# Altium schematic sheet UC3843_Buck.SchDoc
size A4
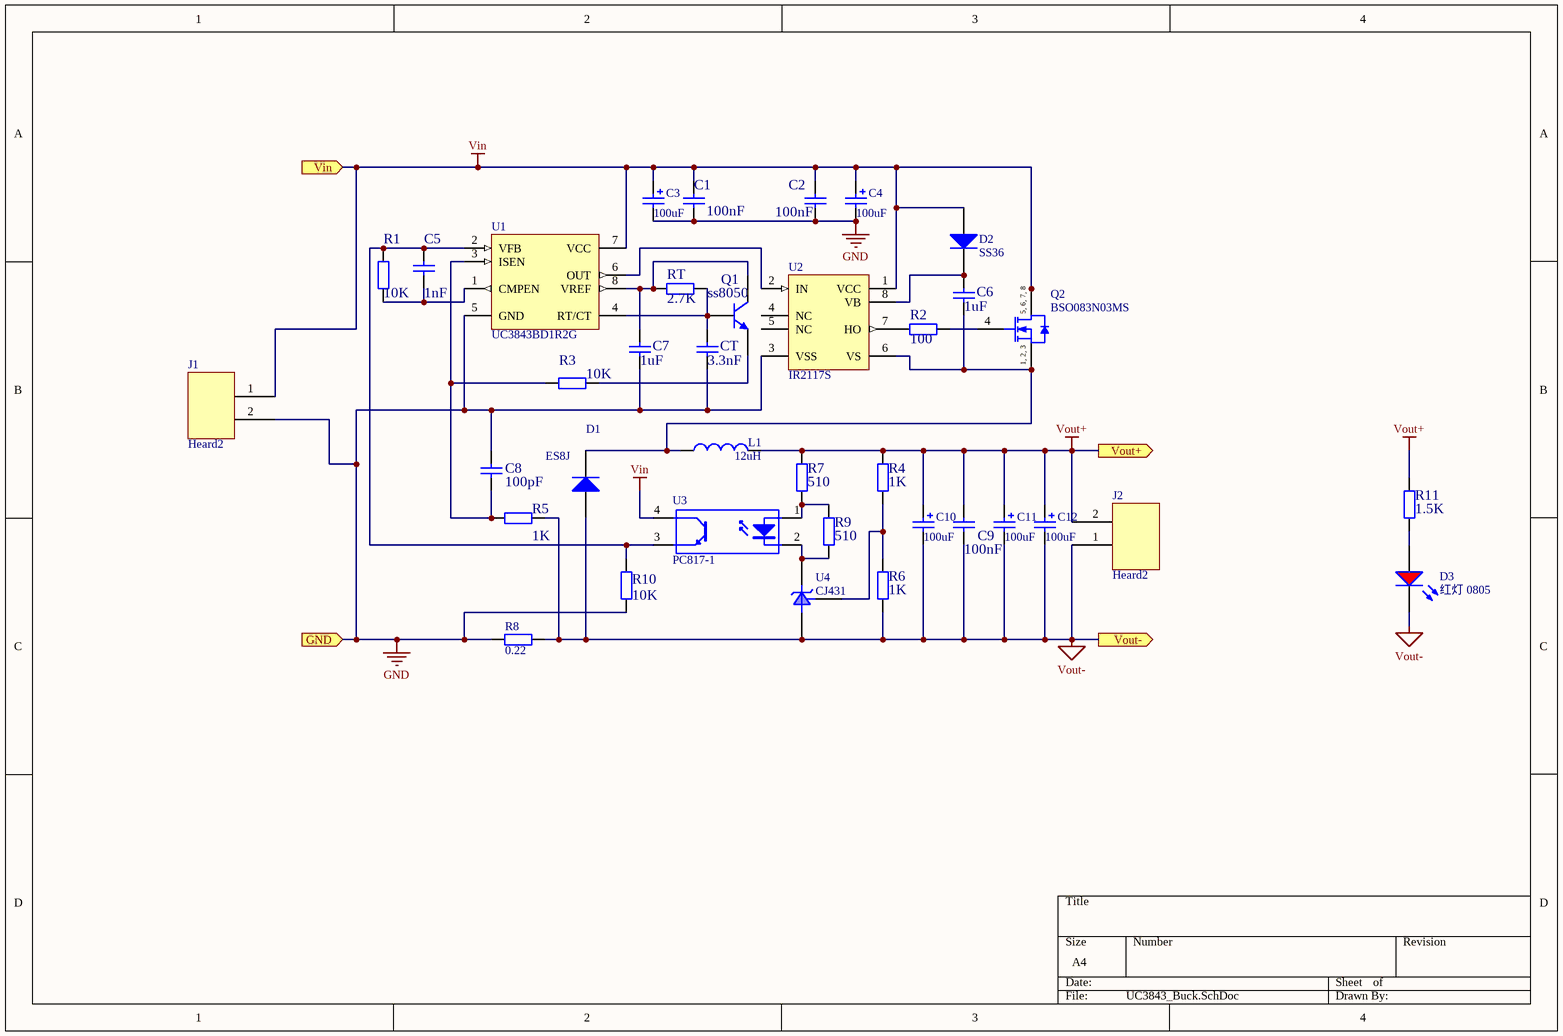
[diagram p0: UC3843_Buck.SchDoc]

## Parts
C1  100nF  [0805_C]
C2  100nF  [0805_C]
C3  100uF  [CASE-B_3528]
C4  100uF  [CASE-B_3528]
C5  1nF  [0805_C]
C6  1uF  [0805R]
C7  1uF  [0805R]
C8  100pF  [0805R]
C9  100nF  [0805_C]
C10  100uF  [CASE-B_3528]
C11  100uF  [CASE-B_3528]
C12  100uF  [CASE-B_3528]
CT  3.3nF  [0805R]
D1  ES8J  [SMC(DO-214AB)_S1]
D2  SS36  [SMC(DO-214AB)_S1]
D3  红灯 0805  [0805_LED_S1]
J1  Heard2  [8.5端子]
J2  Heard2  [8.5端子]
L1  12uH  [L_12uh]
Q1  ss8050  [SOT-23(SOT-23-3)]
Q2  BSO083N03MS  [INF-PG-DSO-8-16_N]
R1  10K  [0805R]
R2  100  [0805R]
R3  10K  [0805R]
R4  1K  [0805R]
R5  1K  [0805R]
R6  1K  [0805R]
R7  510  [0805R]
R8  0.22  [水泥电阻]
R9  510  [0805R]
R10  10K  [0805R]
R11  1.5K  [0805R]
RT  2.7K  [0805R]
U1  UC3843BD1R2G  [SOIC-8_150mil]
U2  IR2117S  [SO-8_N]
U3  PC817-1  [LC-SMD-4]
U4  CJ431  [SOT-23(SOT-23-3)]

## Ports
GND (in), Vin (in), Vout+ (out), Vout- (out)

## Nets
GND: C1.1 C2.1 C3.2 C4.2 C7.2 C8.2 CT.2 J1.2 R8.1 R10.2 U1.5(GND) U2.3(VSS) ; port GND
Vin: C1.2 C2.2 C3.1 C4.1 D2.1(A) J1.1 Q2.5(DRAIN) Q2.6(DRAIN) Q2.7(DRAIN) Q2.8(DRAIN) U1.7(VCC) U2.1(VCC) U3.4(C) ; port Vin
Vout+: C9.2 C10.1 C11.1 C12.1 J2.2 L1.2 R4.2 R7.2 R11.2 ; port Vout+
Vout-: C9.1 C10.2 C11.2 C12.2 D1.1(A) D3.K J2.1 R5.1 R6.1 R8.2 U4.3(A) ; port Vout-
NetC5_1: C5.1 R1.2 U1.1(CMPEN)
NetC5_2: C5.2 R1.1 R10.1 U1.2(VFB) U3.3(E)
NetC6_1: C6.1 D2.2(K) U2.8(VB)
NetC6_2: C6.2 D1.2(K) L1.1 Q2.1(SOURCE) Q2.2(SOURCE) Q2.3(SOURCE) U2.6(VS)
NetC7_1: C7.1 Q1.3(C) RT.1 U1.8(VREF)
NetC8_1: C8.1 R3.2 R5.2 U1.3(ISEN)
NetCT_1: CT.1 Q1.1(B) RT.2 U1.4(RT/CT)
NetD3_A: D3.A R11.1
NetQ1_2: Q1.2(E) R3.1
NetQ2_4: Q2.4(GATE) R2.2
NetR2_1: R2.1 U2.7(HO)
NetR4_1: R4.1 R6.2 U4.1(R)
NetR7_1: R7.1 R9.2 U3.1(A)
NetR9_1: R9.1 U3.2(K) U4.2(K)
NetU1_6: U1.6(OUT) U2.2(IN)

Not connected (* = marked no-connect by the designer): U2 4(NC) 5(NC)

## Notes on the sheet
- (in symbol BSO083N03MS G) 5, 6, 7, 8; 1, 2, 3

## Library data of the parts
C1 C2 C5 C9 = 0805 100nF(104) 10% 50V: 贴片电容; ComponentLink1Description: 供应商链接; ComponentLink1URL: http://www.szlcsc.com/product/details_50686.html; Package: 0805; Supplier: LC; SuppliersPartNumber: C49678
C3 C4 C10-C12 = 3528 100uF (107) 10% 6.3V: 钽电容; ComponentLink1Description: 供应商链接; ComponentLink1URL: http://www.szlcsc.com/product/details_16815.html; Package: 3528; Supplier: LC; SuppliersPartNumber: C16133
C6-C8 CT = Cap: Capacitor; Published: 8-Jun-2000; LatestRevisionDate: 17-Jul-2002; LatestRevisionNote: Re-released for DXP Platform.; PackageReference: RAD-0.3; Publisher: Altium Limited; PackageDescription: Radial Cap, Thru-Hole; 2 Leads; 0.3 in Pin Spacing
  C6 C7: Value: 1uF
  C8: Value: 100pF
  CT: Value: 3.3nF
D1 D2 = SMC(DO-214AB) SS36-E3/57T: 二极管; ComponentLink1Description: 供应商链接; ComponentLink1URL: http://www.szlcsc.com/product/details_36698.html; Package: SMC(DO-214AB); Supplier: LC; SuppliersPartNumber: C35722
D3 = 0805 红灯: 发光二极管; ComponentLink1Description: 供应商链接; ComponentLink1URL: http://www.szlcsc.com/product/details_2668.html; Package: 0805; Supplier: LC; SuppliersPartNumber: C2295
J1 J2 = Header2
L1 = L_12uh
Q1 = SOT-23 SS8050 Y1: 三极管; ComponentLink1Description: 供应商链接; ComponentLink1URL: http://www.szlcsc.com/product/details_2507.html; Package: SOT-23; Supplier: LC; SuppliersPartNumber: C2150
Q2 = BSO083N03MS G: N-Channel OptiMOS 3 M-Series Power-MOSFET, 30 V VDS, 14 A ID, -55 to 150 degC, PG-DSO-8-16, Reel, Green; Manufacturer: Infineon; Green: TRUE; ID (max): 14 A; IDpuls (max): 98 A; Polarity: N; Ptot (max): 2.5 W; QG: 21 nC; RDS (on) (max): 8.3 mOhm; RDS (on) (max) (@4.5V): 10.5 mOhm; Rth: 35 K/W; RthJA (max): 150 K/W; VDS (max): 30 V; VGS(th) (max): 2 V; VGS(th) (min): 1 V; DatasheetVersion: Rev. 1.1; PackageVersion: Mar-07; PackageReference: PG-DSO-8-16; PackageDescription: 8-Pin Plastic (Green) Dual Small Outline Package, 4.9 x 3.9 mm Body, 1.27 mm Pitch; Supplier 1: Digi-Key; Supplier Part Number 1: BSO083N03MS GINTR-ND; Supplier 2: Digi-Key; Supplier Part Number 2: BSO083N03MS GINCT-ND; Supplier 3: Digi-Key; Supplier Part Number 3: BSO083N03MS GINDKR-ND; Halogen-free: TRUE; Packing: Reel; Mounting Technology: Surface Mount; PartNumber: BSO083N03MS G; ComponentLink1Description: Manufacturer URL; ComponentLink1URL: http://www.infineon.com/; ComponentLink2Description: Datasheet; ComponentLink2URL: http://www.infineon.com/dgdl/BSO083N03MS_rev1.1.pdf?folderId=db3a304313d846880113d91d60c500c4&fileId=db3a30431b0626df011b0d64e5db7e1b; ComponentLink3Description: Package Specification; ComponentLink3URL: http://www.infineon.com/dgdl/TLE7259-2GE_DS_rev12.pdf?folderId=db3a3043163797a6011666d32a0c0de1&fileId=db3a3043163797a6011666d4dbb80de2&location=en.Products.Automotive_ICs.Automotive_Transceivers.LIN_Transceivers.DATASHEET.TLE7259-2GE_DS_rev12.pdf
R1-R7 R9-R11 RT = Res2: Resistor; Published: 8-Jun-2000; LatestRevisionDate: 17-Jul-2002; LatestRevisionNote: Re-released for DXP Platform.; PackageReference: AXIAL-0.4; Publisher: Altium Limited; PackageDescription: Axial Device, Thru-Hole; 2 Leads; 0.4 in Pin Spacing
  R1 R3 R10: Value: 10K
  R2: Value: 100
  R4-R6: Value: 1K
  R7 R9: Value: 510
  R11: Value: 1.5K
  RT: Value: 2.7K
R8 = 水泥电阻
U1 = UC3843BD1R2G_[C16414]: 开关电源; ComponentLink1Description: 供应商链接; ComponentLink1URL: http://www.szlcsc.com/product/details_17096.html; Package: SOIC-8_150mil; Supplier: LC; SuppliersPartNumber: C16414
U2 = IR2117S: Single Channel Driver; Note: Pins 4 and 5 not connected (NC).; Published: 8-Jun-2000; LatestRevisionDate: 13-Apr-2006; LatestRevisionNote: IPC-7351 Footprint Added.; DatasheetVersion: PD60146I; PackageVersion: Feb-2001; PackageReference: SO-8; Publisher: Altium Limited; PackageDescription: 8-Pin Plastic Small Outline Integrated Circuit 1.27 mm Pitch; Code_JEDEC: MS-012-AA; Code_IPC: SOIC127P600-8; ComponentLink1Description: Manufacturer Link; ComponentLink1URL: http://www.irf.com/; ComponentLink2Description: Datasheet; ComponentLink2URL: http://www.irf.com/product-info/datasheets/data/ir2117.pdf
U3 = TLP521
U4 = CJ431 0.5%431_[C3113]: 电压基准; ComponentLink1Description: 供应商链接; ComponentLink1URL: http://www.szlcsc.com/product/details_3500.html; Package: SOT-23; Supplier: LC; SuppliersPartNumber: C3113